# Altium project Biderectional Level Shifter.PrjPcb
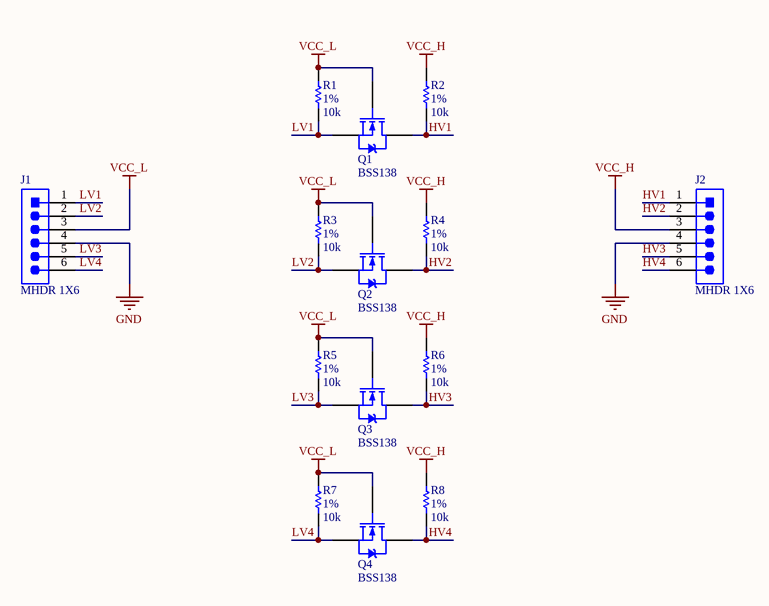
[diagram p0: Top Level.SchDoc]
Author: Andrew Katz
1 sheet, 14 parts. Net scope: global (net labels, ports and power ports of the same name join across sheets).
Board file: Level Shifter.PcbDoc

## Sheet Top Level.SchDoc
size Letter; CompanyName: Penn Electric Racing; DrawnBy: Andrew Katz; Engineer: Andrew Katz; Organization: Penn Electric Racing; Address1: 220 S. 33rd St; Address2: Towne Bldg, B11; Address3: Philadelpia, PA 19104; Address4: USA; SheetNumber: 1; SheetTotal: 1

### Parts
J1  MHDR 1X6  [MHDR 1X6]
J2  MHDR 1X6  [MHDR 1X6]
Q1  BSS138  [SOT-23-3_ONSEMI]
Q2  BSS138  [SOT-23-3_ONSEMI]
Q3  BSS138  [SOT-23-3_ONSEMI]
Q4  BSS138  [SOT-23-3_ONSEMI]
R1  value 10k  Tolerance: 1%  [0603_RES]  (hidden comment: RES 0603 10K 1%)
R2  value 10k  Tolerance: 1%  [0603_RES]  (hidden comment: RES 0603 10K 1%)
R3  value 10k  Tolerance: 1%  [0603_RES]  (hidden comment: RES 0603 10K 1%)
R4  value 10k  Tolerance: 1%  [0603_RES]  (hidden comment: RES 0603 10K 1%)
R5  value 10k  Tolerance: 1%  [0603_RES]  (hidden comment: RES 0603 10K 1%)
R6  value 10k  Tolerance: 1%  [0603_RES]  (hidden comment: RES 0603 10K 1%)
R7  value 10k  Tolerance: 1%  [0603_RES]  (hidden comment: RES 0603 10K 1%)
R8  value 10k  Tolerance: 1%  [0603_RES]  (hidden comment: RES 0603 10K 1%)

### Nets
GND: J1.4 J2.4
VCC_H: J2.3 R2.2 R4.2 R6.2 R8.2
VCC_L: J1.3 Q1.1(G) Q2.1(G) Q3.1(G) Q4.1(G) R1.2 R3.2 R5.2 R7.2
HV1: J2.1 Q1.3(D) R2.1
HV2: J2.2 Q2.3(D) R4.1
HV3: J2.5 Q3.3(D) R6.1
HV4: J2.6 Q4.3(D) R8.1
LV1: J1.1 Q1.2(S) R1.1
LV2: J1.2 Q2.2(S) R3.1
LV3: J1.5 Q3.2(S) R5.1
LV4: J1.6 Q4.2(S) R7.1

### Notes on the sheet
- Title:
- Desc:
- Size:
- Letter
- Auth:
- Proj:
- Sheet
- of
- www.seas.upenn.edu
- Electrical and Systems Engineering

### Library data of the parts
J1 J2 = CMP-00091-3: Header, 6-Pin, 0.1in Pitch, Male; Body Length: 0.6inch; Reference Standard: UL; Contact Pattern: RECTANGULAR; Reliability: COMMERCIAL; Connector Type: BOARD CONNECTOR; Contact Resistance: 20mR; Number of Contacts: 6; Body Depth: 0.1inch; Mounting Option 1: LOCKING; Contact Style: SQ PIN-SKT; Body/Shell Style: PLUG; Number Of Connectors: 1; Rated Current (Signal): 3A; Insulation Resistance: 1GR; Pitch: 0.1 inch; Dielectric Withstanding Voltage (AC): 500V; Mounting Technology: Board; Termination: Solder; Terminal Pitch: 2.54mm; Mounting Style: STRAIGHT; Contact Finish - Termination: Gold (Au) - with Nickel (Ni) barrier; PCB Contact Pattern: RECTANGULAR; Max Operating Temperature: 125°C; Number of Rows Loaded: 1; JESD-609 Code: e4; Min Operating Temperature: -40°C; RoHS Compliant: Yes; Contact Gender: Male; Reach SVHC Compliant: Yes; Insulation Material: Polybutylene; Contact Material: Copper Alloy; Terminal Length: 0.118inch; Body Breadth: 0.1inch; Insulation Color: Black; Contact Finish - Mating: GOLD; Mating Contact Pitch: 0.1inch; JLCPCB Part #: C178289
Q1-Q4 = CMP-00090-4: Small Signal Field-Effect Transistor, 0.22A I(D), 50V, 1-Element, N-Channel, Silicon, Metal-oxide Semiconductor FET; I_D (Max Continuous): 220mA; V_GSS (Max): 20V; V_DSS (Max): 50V; JLCPCB Part #: C52895
R1-R8 = CMP-005-002156-2: Resistor Surface Mount, 10K Ohms, 0603 Footprint, 1% Tolerance 0.1W; Manufacturer: Various; PCB Package: 0603; Description in Visual: Res SMT 10K 0603  1%  0.1W; Manufacturer P/N: RES 0603 10K 1%; Mount: SMT; JLCPCB Part #: C25804; Power Rating: 0.1W